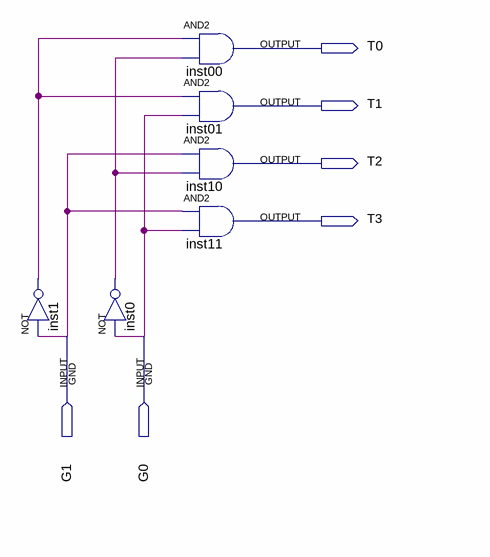
[diagram p0: schematic sheet]
// Quartus schematic DEC2TO4.bdf as structural Verilog: 6 symbols, 6 pins
module DEC2TO4 (
  input  G1,
  input  G0,
  output T0,
  output T1,
  output T2,
  output T3
);

  wire inst0_out, inst1_out;

  not inst1 (inst1_out, G1);
  not inst0 (inst0_out, G0);
  and inst00 (T0, inst1_out, inst0_out);
  and inst01 (T1, inst1_out, G0);
  and inst10 (T2, G1, inst0_out);
  and inst11 (T3, G1, G0);
endmodule
